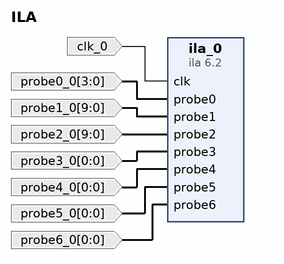
[diagram p0: block diagram of the top level]
# Vivado block design ILA, xc7a35ticsg324-1L, Vivado 2024.2
create_bd_design ILA

create_bd_port -dir I -from 9 -to 0 probe2_0
create_bd_port -dir I -type clk clk_0
create_bd_port -dir I -from 3 -to 0 probe0_0
create_bd_port -dir I -from 9 -to 0 probe1_0
create_bd_port -dir I -from 0 -to 0 probe3_0
create_bd_port -dir I -from 0 -to 0 probe4_0
create_bd_port -dir I -from 0 -to 0 probe5_0
create_bd_port -dir I -from 0 -to 0 probe6_0

create_bd_cell -type ip -vlnv xilinx.com:ip:ila:6.2 ila_0
set_property -dict [list \
  CONFIG.C_MONITOR_TYPE Native \
  CONFIG.C_NUM_OF_PROBES 7 \
  CONFIG.C_PROBE0_WIDTH 4 \
  CONFIG.C_PROBE1_WIDTH 10 \
  CONFIG.C_PROBE2_WIDTH 10 \
] [get_bd_cells ila_0]

# ---- connections ----

connect_bd_net -net clk_0_1 [get_bd_ports clk_0] [get_bd_pins ila_0/clk]
connect_bd_net -net probe0_0_1 [get_bd_ports probe0_0] [get_bd_pins ila_0/probe0]
connect_bd_net -net probe1_0_1 [get_bd_ports probe1_0] [get_bd_pins ila_0/probe1]
connect_bd_net -net probe2_0_1 [get_bd_ports probe2_0] [get_bd_pins ila_0/probe2]
connect_bd_net -net probe3_0_1 [get_bd_ports probe3_0] [get_bd_pins ila_0/probe3]
connect_bd_net -net probe4_0_1 [get_bd_ports probe4_0] [get_bd_pins ila_0/probe4]
connect_bd_net -net probe5_0_1 [get_bd_ports probe5_0] [get_bd_pins ila_0/probe5]
connect_bd_net -net probe6_0_1 [get_bd_ports probe6_0] [get_bd_pins ila_0/probe6]

validate_bd_design
save_bd_design
